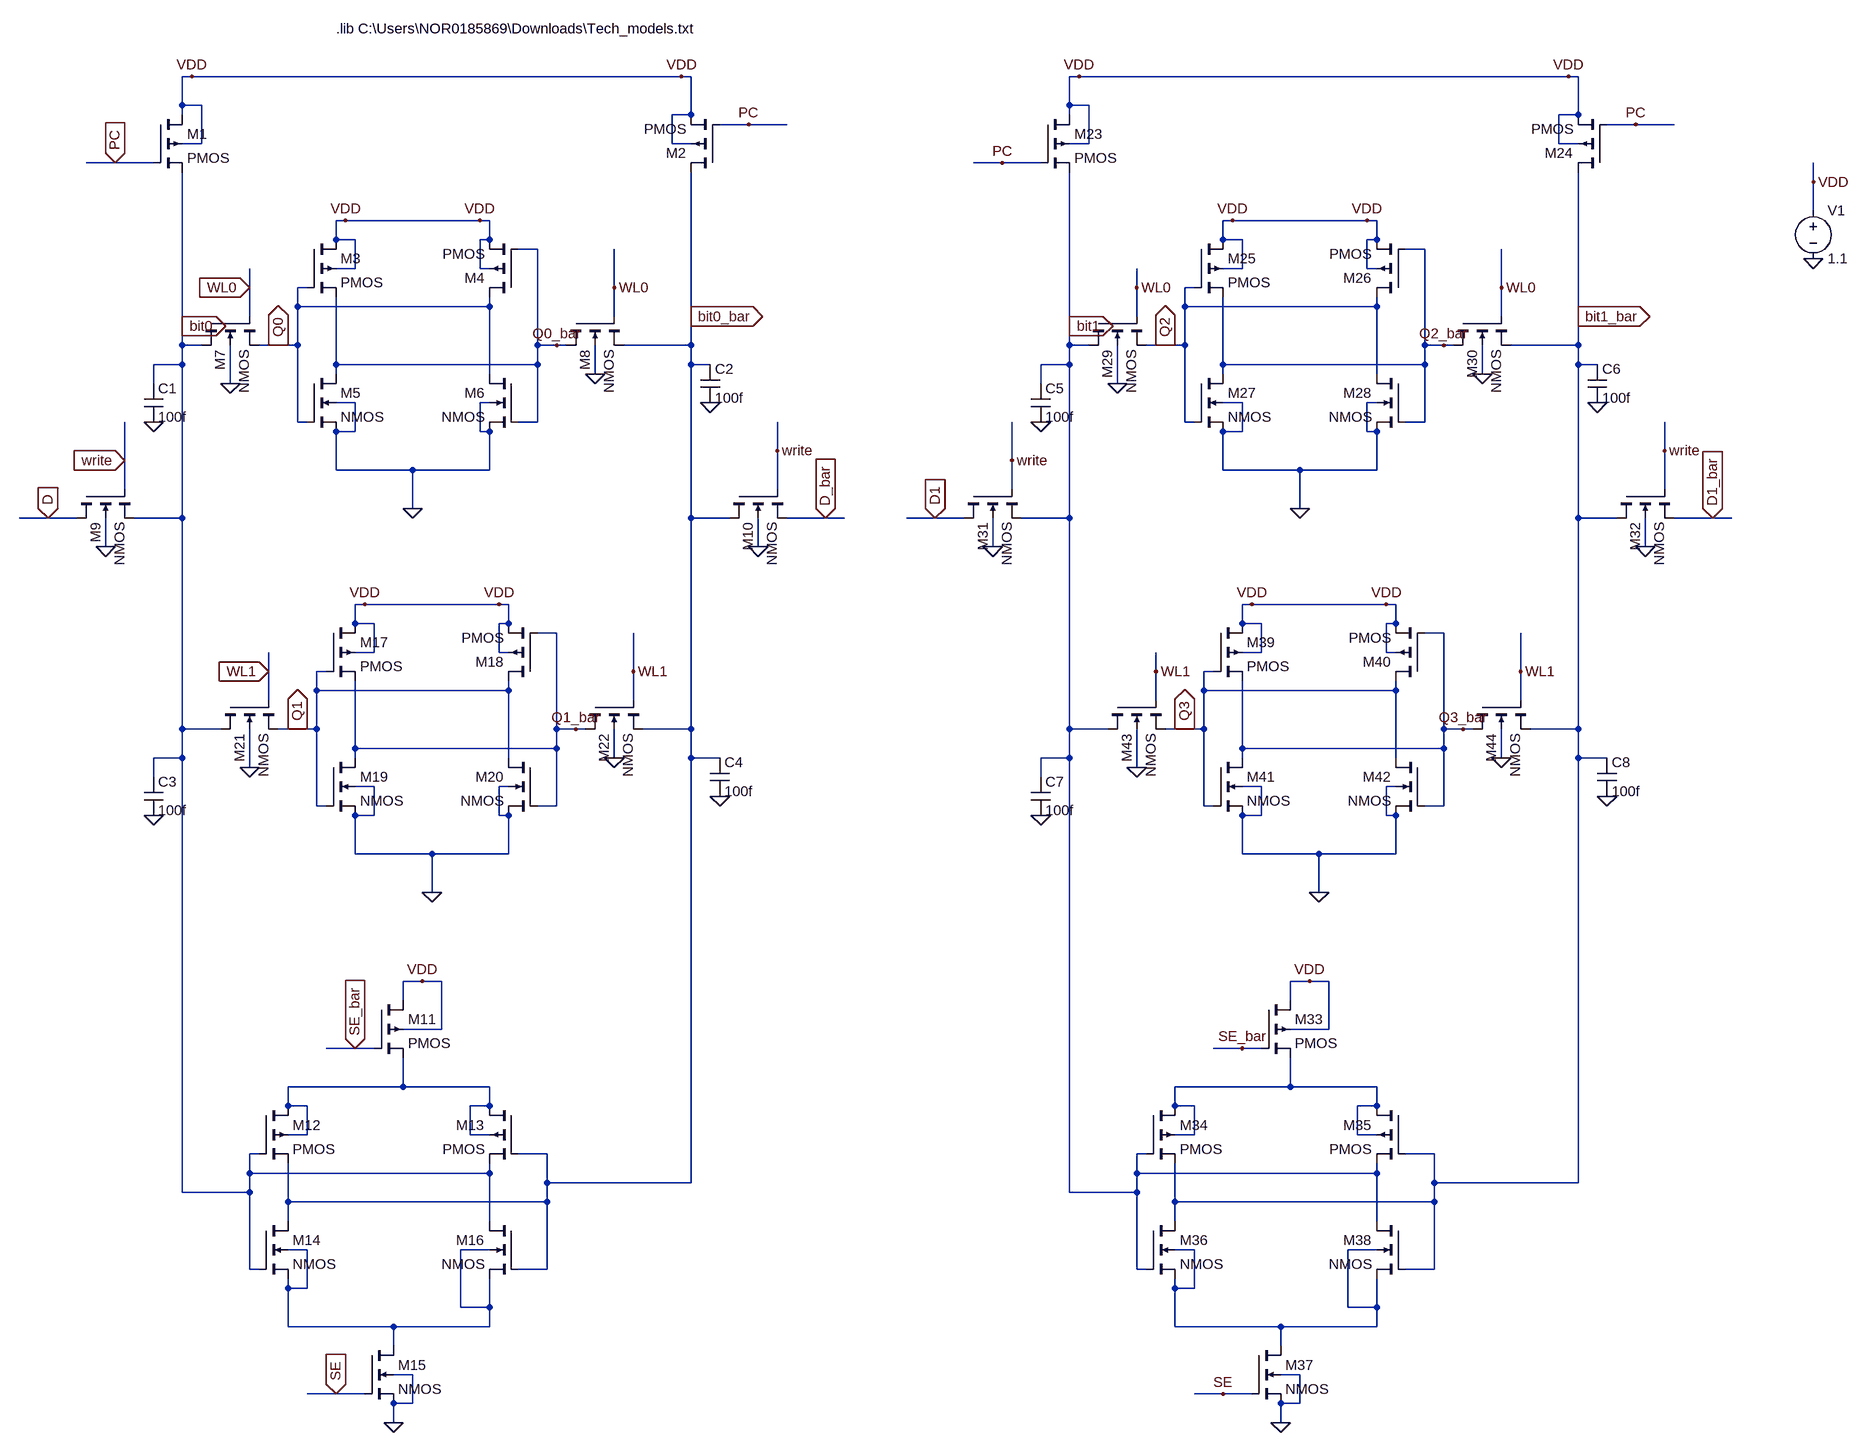
[diagram p0: schematic SRAM2x2.asc]
SRAM2x2.asc, the LTspice schematic file:
Version 4
SHEET 1 2384 2436
WIRE -688 160 -704 160
WIRE 128 160 -688 160
WIRE 144 160 128 160
WIRE 896 160 880 160
WIRE 1712 160 896 160
WIRE 1728 160 1712 160
WIRE -704 208 -704 160
WIRE -672 208 -704 208
WIRE 880 208 880 160
WIRE 912 208 880 208
WIRE -704 224 -704 208
WIRE 144 224 144 160
WIRE 144 224 112 224
WIRE 880 224 880 208
WIRE 1728 224 1728 160
WIRE 1728 224 1696 224
WIRE 240 240 192 240
WIRE 304 240 240 240
WIRE 1824 240 1776 240
WIRE 1888 240 1824 240
WIRE -672 272 -672 208
WIRE -672 272 -704 272
WIRE 112 272 112 224
WIRE 144 272 112 272
WIRE 912 272 912 208
WIRE 912 272 880 272
WIRE 1696 272 1696 224
WIRE 1728 272 1696 272
WIRE -816 304 -864 304
WIRE -752 304 -816 304
WIRE 768 304 720 304
WIRE 832 304 768 304
WIRE 2320 336 2320 304
WIRE 2320 384 2320 336
WIRE -432 400 -448 400
WIRE -208 400 -432 400
WIRE -192 400 -208 400
WIRE 1152 400 1136 400
WIRE 1376 400 1152 400
WIRE 1392 400 1376 400
WIRE -448 432 -448 400
WIRE -416 432 -448 432
WIRE -192 432 -192 400
WIRE -192 432 -208 432
WIRE 1136 432 1136 400
WIRE 1168 432 1136 432
WIRE 1392 432 1392 400
WIRE 1392 432 1376 432
WIRE -112 448 -144 448
WIRE 1472 448 1440 448
WIRE -416 480 -416 432
WIRE -416 480 -448 480
WIRE -208 480 -208 432
WIRE -192 480 -208 480
WIRE 1168 480 1168 432
WIRE 1168 480 1136 480
WIRE 1376 480 1376 432
WIRE 1392 480 1376 480
WIRE -592 512 -592 480
WIRE -496 512 -512 512
WIRE 16 512 16 448
WIRE 992 512 992 480
WIRE 1088 512 1072 512
WIRE 1600 512 1600 448
WIRE -512 544 -512 512
WIRE -192 544 -192 528
WIRE -192 544 -512 544
WIRE 1072 544 1072 512
WIRE 1392 544 1392 528
WIRE 1392 544 1072 544
WIRE -592 560 -592 512
WIRE 16 560 16 512
WIRE 144 560 144 320
WIRE 992 560 992 512
WIRE 1600 560 1600 512
WIRE 1728 560 1728 320
WIRE -704 576 -704 320
WIRE 880 576 880 320
WIRE -704 608 -704 576
WIRE -672 608 -704 608
WIRE -544 608 -576 608
WIRE -512 608 -512 544
WIRE -512 608 -544 608
WIRE -112 608 -112 448
WIRE -80 608 -112 608
WIRE -64 608 -80 608
WIRE 144 608 144 560
WIRE 144 608 32 608
WIRE 880 608 880 576
WIRE 912 608 880 608
WIRE 1040 608 1008 608
WIRE 1072 608 1072 544
WIRE 1072 608 1040 608
WIRE 1472 608 1472 448
WIRE 1504 608 1472 608
WIRE 1520 608 1504 608
WIRE 1728 608 1728 560
WIRE 1728 608 1616 608
WIRE -704 640 -704 608
WIRE -704 640 -752 640
WIRE -448 640 -448 528
WIRE -112 640 -112 608
WIRE -112 640 -448 640
WIRE 144 640 144 608
WIRE 176 640 144 640
WIRE 880 640 880 608
WIRE 880 640 832 640
WIRE 1136 640 1136 528
WIRE 1472 640 1472 608
WIRE 1472 640 1136 640
WIRE 1728 640 1728 608
WIRE 1760 640 1728 640
WIRE -448 656 -448 640
WIRE -192 656 -192 544
WIRE -16 656 -16 608
WIRE 1136 656 1136 640
WIRE 1392 656 1392 544
WIRE 1568 656 1568 608
WIRE -752 672 -752 640
WIRE -624 672 -624 608
WIRE 832 672 832 640
WIRE 960 672 960 608
WIRE -416 704 -448 704
WIRE -192 704 -208 704
WIRE 1168 704 1136 704
WIRE 1392 704 1376 704
WIRE -512 736 -512 608
WIRE -496 736 -512 736
WIRE -112 736 -112 640
WIRE -112 736 -144 736
WIRE 1072 736 1072 608
WIRE 1088 736 1072 736
WIRE 1472 736 1472 640
WIRE 1472 736 1440 736
WIRE -416 752 -416 704
WIRE -416 752 -448 752
WIRE -208 752 -208 704
WIRE -192 752 -208 752
WIRE 1168 752 1168 704
WIRE 1168 752 1136 752
WIRE 1376 752 1376 704
WIRE 1392 752 1376 752
WIRE 288 784 288 736
WIRE 1872 784 1872 736
WIRE -800 800 -800 736
WIRE 784 800 784 736
WIRE -448 816 -448 752
WIRE -320 816 -448 816
WIRE -192 816 -192 752
WIRE -192 816 -320 816
WIRE 1136 816 1136 752
WIRE 1264 816 1136 816
WIRE 1392 816 1392 752
WIRE 1392 816 1264 816
WIRE -800 848 -800 800
WIRE 288 848 288 784
WIRE 784 848 784 800
WIRE 1872 848 1872 784
WIRE -320 880 -320 816
WIRE 1264 880 1264 816
WIRE -928 896 -976 896
WIRE -880 896 -928 896
WIRE -704 896 -704 640
WIRE -704 896 -784 896
WIRE 144 896 144 640
WIRE 208 896 144 896
WIRE 368 896 304 896
WIRE 400 896 368 896
WIRE 656 896 608 896
WIRE 704 896 656 896
WIRE 880 896 880 640
WIRE 880 896 800 896
WIRE 1728 896 1728 640
WIRE 1792 896 1728 896
WIRE 1952 896 1888 896
WIRE 1984 896 1952 896
WIRE -832 944 -832 896
WIRE 256 944 256 896
WIRE 752 944 752 896
WIRE 1840 944 1840 896
WIRE -400 1040 -416 1040
WIRE -176 1040 -400 1040
WIRE -160 1040 -176 1040
WIRE 1184 1040 1168 1040
WIRE 1408 1040 1184 1040
WIRE 1424 1040 1408 1040
WIRE -416 1072 -416 1040
WIRE -384 1072 -416 1072
WIRE -160 1072 -160 1040
WIRE -160 1072 -176 1072
WIRE 1168 1072 1168 1040
WIRE 1200 1072 1168 1072
WIRE 1424 1072 1424 1040
WIRE 1424 1072 1408 1072
WIRE -80 1088 -112 1088
WIRE 1504 1088 1472 1088
WIRE -384 1120 -384 1072
WIRE -384 1120 -416 1120
WIRE -176 1120 -176 1072
WIRE -160 1120 -176 1120
WIRE 1200 1120 1200 1072
WIRE 1200 1120 1168 1120
WIRE 1408 1120 1408 1072
WIRE 1424 1120 1408 1120
WIRE -560 1152 -560 1120
WIRE -464 1152 -480 1152
WIRE 48 1152 48 1088
WIRE 1024 1152 1024 1120
WIRE 1120 1152 1104 1152
WIRE 1632 1152 1632 1088
WIRE -480 1184 -480 1152
WIRE -160 1184 -160 1168
WIRE -160 1184 -480 1184
WIRE 1104 1184 1104 1152
WIRE 1424 1184 1424 1168
WIRE 1424 1184 1104 1184
WIRE -560 1200 -560 1152
WIRE 48 1200 48 1152
WIRE 1024 1200 1024 1152
WIRE 1632 1200 1632 1152
WIRE -704 1248 -704 896
WIRE -640 1248 -704 1248
WIRE -512 1248 -544 1248
WIRE -480 1248 -480 1184
WIRE -480 1248 -512 1248
WIRE -80 1248 -80 1088
WIRE -48 1248 -80 1248
WIRE -32 1248 -48 1248
WIRE 144 1248 144 896
WIRE 144 1248 64 1248
WIRE 880 1248 880 896
WIRE 944 1248 880 1248
WIRE 1072 1248 1040 1248
WIRE 1104 1248 1104 1184
WIRE 1104 1248 1072 1248
WIRE 1504 1248 1504 1088
WIRE 1536 1248 1504 1248
WIRE 1552 1248 1536 1248
WIRE 1728 1248 1728 896
WIRE 1728 1248 1648 1248
WIRE -416 1280 -416 1168
WIRE -80 1280 -80 1248
WIRE -80 1280 -416 1280
WIRE 1168 1280 1168 1168
WIRE 1504 1280 1504 1248
WIRE 1504 1280 1168 1280
WIRE -704 1296 -704 1248
WIRE -704 1296 -752 1296
WIRE -416 1296 -416 1280
WIRE -160 1296 -160 1184
WIRE 16 1296 16 1248
WIRE 144 1296 144 1248
WIRE 192 1296 144 1296
WIRE 880 1296 880 1248
WIRE 880 1296 832 1296
WIRE 1168 1296 1168 1280
WIRE 1424 1296 1424 1184
WIRE 1600 1296 1600 1248
WIRE 1728 1296 1728 1248
WIRE 1776 1296 1728 1296
WIRE -592 1312 -592 1248
WIRE 992 1312 992 1248
WIRE -752 1328 -752 1296
WIRE 832 1328 832 1296
WIRE -384 1344 -416 1344
WIRE -160 1344 -176 1344
WIRE 1200 1344 1168 1344
WIRE 1424 1344 1408 1344
WIRE -480 1376 -480 1248
WIRE -464 1376 -480 1376
WIRE -80 1376 -80 1280
WIRE -80 1376 -112 1376
WIRE 1104 1376 1104 1248
WIRE 1120 1376 1104 1376
WIRE 1504 1376 1504 1280
WIRE 1504 1376 1472 1376
WIRE -384 1392 -384 1344
WIRE -384 1392 -416 1392
WIRE -176 1392 -176 1344
WIRE -160 1392 -176 1392
WIRE 1200 1392 1200 1344
WIRE 1200 1392 1168 1392
WIRE 1408 1392 1408 1344
WIRE 1424 1392 1408 1392
WIRE -416 1456 -416 1392
WIRE -288 1456 -416 1456
WIRE -160 1456 -160 1392
WIRE -160 1456 -288 1456
WIRE 1168 1456 1168 1392
WIRE 1296 1456 1168 1456
WIRE 1424 1456 1424 1392
WIRE 1424 1456 1296 1456
WIRE -288 1520 -288 1456
WIRE 1296 1520 1296 1456
WIRE -304 1680 -336 1680
WIRE -272 1680 -304 1680
WIRE 1280 1680 1248 1680
WIRE 1312 1680 1280 1680
WIRE -336 1712 -336 1680
WIRE 1248 1712 1248 1680
WIRE -272 1760 -272 1680
WIRE -272 1760 -336 1760
WIRE 1312 1760 1312 1680
WIRE 1312 1760 1248 1760
WIRE -416 1792 -464 1792
WIRE -384 1792 -416 1792
WIRE 1168 1792 1120 1792
WIRE 1200 1792 1168 1792
WIRE -336 1856 -336 1808
WIRE -336 1856 -528 1856
WIRE -192 1856 -336 1856
WIRE 1248 1856 1248 1808
WIRE 1248 1856 1056 1856
WIRE 1392 1856 1248 1856
WIRE -528 1888 -528 1856
WIRE -496 1888 -528 1888
WIRE -192 1888 -192 1856
WIRE -192 1888 -224 1888
WIRE 1056 1888 1056 1856
WIRE 1088 1888 1056 1888
WIRE 1392 1888 1392 1856
WIRE 1392 1888 1360 1888
WIRE -496 1936 -496 1888
WIRE -496 1936 -528 1936
WIRE -224 1936 -224 1888
WIRE -192 1936 -224 1936
WIRE 1088 1936 1088 1888
WIRE 1088 1936 1056 1936
WIRE 1360 1936 1360 1888
WIRE 1392 1936 1360 1936
WIRE -576 1968 -592 1968
WIRE -96 1968 -144 1968
WIRE 1008 1968 992 1968
WIRE 1488 1968 1440 1968
WIRE -592 2000 -592 1968
WIRE -192 2000 -192 1984
WIRE -192 2000 -592 2000
WIRE 992 2000 992 1968
WIRE 1392 2000 1392 1984
WIRE 1392 2000 992 2000
WIRE -96 2016 -96 1968
WIRE 144 2016 144 1296
WIRE 144 2016 -96 2016
WIRE 1488 2016 1488 1968
WIRE 1728 2016 1728 1296
WIRE 1728 2016 1488 2016
WIRE -704 2032 -704 1296
WIRE -592 2032 -592 2000
WIRE -592 2032 -704 2032
WIRE 880 2032 880 1296
WIRE 992 2032 992 2000
WIRE 992 2032 880 2032
WIRE -528 2048 -528 1984
WIRE -96 2048 -96 2016
WIRE -96 2048 -528 2048
WIRE 1056 2048 1056 1984
WIRE 1488 2048 1488 2016
WIRE 1488 2048 1056 2048
WIRE -528 2080 -528 2048
WIRE -192 2080 -192 2000
WIRE 1056 2080 1056 2048
WIRE 1392 2080 1392 2000
WIRE -496 2128 -528 2128
WIRE -192 2128 -240 2128
WIRE 1088 2128 1056 2128
WIRE 1392 2128 1344 2128
WIRE -592 2160 -592 2032
WIRE -576 2160 -592 2160
WIRE -96 2160 -96 2048
WIRE -96 2160 -144 2160
WIRE 992 2160 992 2032
WIRE 1008 2160 992 2160
WIRE 1488 2160 1488 2048
WIRE 1488 2160 1440 2160
WIRE -528 2192 -528 2176
WIRE -496 2192 -496 2128
WIRE -496 2192 -528 2192
WIRE 1056 2192 1056 2176
WIRE 1088 2192 1088 2128
WIRE 1088 2192 1056 2192
WIRE -240 2224 -240 2128
WIRE -192 2224 -192 2176
WIRE -192 2224 -240 2224
WIRE 1344 2224 1344 2128
WIRE 1392 2224 1392 2176
WIRE 1392 2224 1344 2224
WIRE -528 2256 -528 2192
WIRE -352 2256 -528 2256
WIRE -192 2256 -192 2224
WIRE -192 2256 -352 2256
WIRE 1056 2256 1056 2192
WIRE 1232 2256 1056 2256
WIRE 1392 2256 1392 2224
WIRE 1392 2256 1232 2256
WIRE -352 2288 -352 2256
WIRE 1232 2288 1232 2256
WIRE -320 2336 -352 2336
WIRE 1264 2336 1232 2336
WIRE -448 2368 -496 2368
WIRE -400 2368 -448 2368
WIRE 1136 2368 1088 2368
WIRE 1184 2368 1136 2368
WIRE -320 2384 -320 2336
WIRE -320 2384 -352 2384
WIRE 1264 2384 1264 2336
WIRE 1264 2384 1232 2384
WIRE -352 2416 -352 2384
WIRE 1232 2416 1232 2384
FLAG -624 672 0
FLAG -16 656 0
FLAG -320 880 0
FLAG 256 944 0
FLAG -832 944 0
FLAG -352 2416 0
FLAG -688 160 VDD
FLAG 128 160 VDD
FLAG -304 1680 VDD
FLAG -816 304 PC
IOPIN -816 304 In
FLAG 240 240 PC
FLAG -592 512 WL0
IOPIN -592 512 In
FLAG 16 512 WL0
FLAG -704 576 bit0
IOPIN -704 576 Out
FLAG 144 560 bit0_bar
IOPIN 144 560 Out
FLAG -80 608 Q0_bar
FLAG -544 608 Q0
IOPIN -544 608 Out
FLAG -800 800 write
IOPIN -800 800 In
FLAG -928 896 D
IOPIN -928 896 In
FLAG 288 784 write
FLAG 368 896 D_bar
IOPIN 368 896 In
FLAG -416 1792 SE_bar
IOPIN -416 1792 In
FLAG -448 2368 SE
IOPIN -448 2368 In
FLAG -752 736 0
FLAG 176 704 0
FLAG -432 400 VDD
FLAG -208 400 VDD
FLAG -592 1312 0
FLAG 16 1296 0
FLAG -288 1520 0
FLAG -560 1152 WL1
IOPIN -560 1152 In
FLAG 48 1152 WL1
FLAG -48 1248 Q1_bar
FLAG -512 1248 Q1
IOPIN -512 1248 Out
FLAG -400 1040 VDD
FLAG -176 1040 VDD
FLAG -752 1392 0
FLAG 192 1360 0
FLAG 960 672 0
FLAG 1568 656 0
FLAG 1264 880 0
FLAG 1840 944 0
FLAG 752 944 0
FLAG 1232 2416 0
FLAG 896 160 VDD
FLAG 1712 160 VDD
FLAG 1280 1680 VDD
FLAG 768 304 PC
FLAG 1824 240 PC
FLAG 992 512 WL0
FLAG 1600 512 WL0
FLAG 880 576 bit1
IOPIN 880 576 Out
FLAG 1728 560 bit1_bar
IOPIN 1728 560 Out
FLAG 1504 608 Q2_bar
FLAG 1040 608 Q2
IOPIN 1040 608 Out
FLAG 784 800 write
FLAG 656 896 D1
IOPIN 656 896 In
FLAG 1872 784 write
FLAG 1952 896 D1_bar
IOPIN 1952 896 In
FLAG 1168 1792 SE_bar
FLAG 1136 2368 SE
FLAG 832 736 0
FLAG 1760 704 0
FLAG 1152 400 VDD
FLAG 1376 400 VDD
FLAG 992 1312 0
FLAG 1600 1296 0
FLAG 1296 1520 0
FLAG 1024 1152 WL1
FLAG 1632 1152 WL1
FLAG 1536 1248 Q3_bar
FLAG 1072 1248 Q3
IOPIN 1072 1248 Out
FLAG 1184 1040 VDD
FLAG 1408 1040 VDD
FLAG 832 1392 0
FLAG 1776 1360 0
FLAG 2320 464 0
FLAG 2320 336 VDD
SYMBOL pmos4 -752 224 R0
SYMATTR InstName M1
SYMATTR Value2 l=32n w=1280n
SYMBOL pmos4 192 320 R180
SYMATTR InstName M2
SYMATTR Value2 l=32n  w=1280n
SYMBOL pmos4 -496 432 R0
SYMATTR InstName M3
SYMATTR Value2 l=250n w=600n
SYMBOL pmos4 -144 528 R180
SYMATTR InstName M4
SYMATTR Value2 l=250n  w=600n
SYMBOL nmos4 -496 656 R0
SYMATTR InstName M5
SYMATTR Value2 l=32n w=64n
SYMBOL nmos4 -144 656 M0
SYMATTR InstName M6
SYMATTR Value2 l=32n w=64n
SYMBOL nmos4 -672 560 M90
SYMATTR InstName M7
SYMATTR Value2 l=250n w=100n
SYMBOL nmos4 -64 560 M90
SYMATTR InstName M8
SYMATTR Value2 l=250n w=100n
SYMBOL nmos4 -880 848 M90
SYMATTR InstName M9
SYMATTR Value2 l=32n w=1000n
SYMBOL nmos4 208 848 M90
SYMATTR InstName M10
SYMATTR Value2 l=32n w=1000n
SYMBOL pmos4 -384 1712 R0
SYMATTR InstName M11
SYMATTR Value2 l=32n w=640n
SYMBOL pmos4 -576 1888 R0
SYMATTR InstName M12
SYMATTR Value2 l=32n w=64n
SYMBOL pmos4 -144 1888 M0
SYMATTR InstName M13
SYMATTR Value2 l=32n w=64n
SYMBOL nmos4 -576 2080 R0
SYMATTR InstName M14
SYMATTR Value2 l=32n w=640n
SYMBOL nmos4 -400 2288 R0
SYMATTR InstName M15
SYMATTR Value2 l=32n w=640n
SYMBOL nmos4 -144 2080 M0
SYMATTR InstName M16
SYMATTR Value2 l=32n w=640n
SYMBOL cap -768 672 R0
SYMATTR InstName C1
SYMATTR Value 100f
SYMBOL cap 160 640 R0
SYMATTR InstName C2
SYMATTR Value 100f
SYMBOL pmos4 -464 1072 R0
SYMATTR InstName M17
SYMATTR Value2 l=250n w=600n
SYMBOL pmos4 -112 1168 R180
SYMATTR InstName M18
SYMATTR Value2 l=250n  w=600n
SYMBOL nmos4 -464 1296 R0
SYMATTR InstName M19
SYMATTR Value2 l=32n w=64n
SYMBOL nmos4 -112 1296 M0
SYMATTR InstName M20
SYMATTR Value2 l=32n w=64n
SYMBOL nmos4 -640 1200 M90
SYMATTR InstName M21
SYMATTR Value2 l=250n w=100n
SYMBOL nmos4 -32 1200 M90
SYMATTR InstName M22
SYMATTR Value2 l=250n w=100n
SYMBOL cap -768 1328 R0
SYMATTR InstName C3
SYMATTR Value 100f
SYMBOL cap 176 1296 R0
SYMATTR InstName C4
SYMATTR Value 100f
SYMBOL pmos4 832 224 R0
SYMATTR InstName M23
SYMATTR Value2 l=32n w=1280n
SYMBOL pmos4 1776 320 R180
SYMATTR InstName M24
SYMATTR Value2 l=32n  w=1280n
SYMBOL pmos4 1088 432 R0
SYMATTR InstName M25
SYMATTR Value2 l=250n w=600n
SYMBOL pmos4 1440 528 R180
SYMATTR InstName M26
SYMATTR Value2 l=250n  w=600n
SYMBOL nmos4 1088 656 R0
SYMATTR InstName M27
SYMATTR Value2 l=32n w=64n
SYMBOL nmos4 1440 656 M0
SYMATTR InstName M28
SYMATTR Value2 l=32n w=64n
SYMBOL nmos4 912 560 M90
SYMATTR InstName M29
SYMATTR Value2 l=250n w=100n
SYMBOL nmos4 1520 560 M90
SYMATTR InstName M30
SYMATTR Value2 l=250n w=100n
SYMBOL nmos4 704 848 M90
SYMATTR InstName M31
SYMATTR Value2 l=32n w=1000n
SYMBOL nmos4 1792 848 M90
SYMATTR InstName M32
SYMATTR Value2 l=32n w=1000n
SYMBOL pmos4 1200 1712 R0
SYMATTR InstName M33
SYMATTR Value2 l=32n w=640n
SYMBOL pmos4 1008 1888 R0
SYMATTR InstName M34
SYMATTR Value2 l=32n w=64n
SYMBOL pmos4 1440 1888 M0
SYMATTR InstName M35
SYMATTR Value2 l=32n w=64n
SYMBOL nmos4 1008 2080 R0
SYMATTR InstName M36
SYMATTR Value2 l=32n w=640n
SYMBOL nmos4 1184 2288 R0
SYMATTR InstName M37
SYMATTR Value2 l=32n w=640n
SYMBOL nmos4 1440 2080 M0
SYMATTR InstName M38
SYMATTR Value2 l=32n w=640n
SYMBOL cap 816 672 R0
SYMATTR InstName C5
SYMATTR Value 100f
SYMBOL cap 1744 640 R0
SYMATTR InstName C6
SYMATTR Value 100f
SYMBOL pmos4 1120 1072 R0
SYMATTR InstName M39
SYMATTR Value2 l=250n w=600n
SYMBOL pmos4 1472 1168 R180
SYMATTR InstName M40
SYMATTR Value2 l=250n  w=600n
SYMBOL nmos4 1120 1296 R0
SYMATTR InstName M41
SYMATTR Value2 l=32n w=64n
SYMBOL nmos4 1472 1296 M0
SYMATTR InstName M42
SYMATTR Value2 l=32n w=64n
SYMBOL nmos4 944 1200 M90
SYMATTR InstName M43
SYMATTR Value2 l=250n w=100n
SYMBOL nmos4 1552 1200 M90
SYMATTR InstName M44
SYMATTR Value2 l=250n w=100n
SYMBOL cap 816 1328 R0
SYMATTR InstName C7
SYMATTR Value 100f
SYMBOL cap 1760 1296 R0
SYMATTR InstName C8
SYMATTR Value 100f
SYMBOL voltage 2320 368 R0
WINDOW 123 0 0 Left 0
WINDOW 39 0 0 Left 0
SYMATTR InstName V1
SYMATTR Value 1.1
TEXT -448 80 Left 2 !.lib C:\\Users\\NOR0185869\\Downloads\\Tech_models.txt

The netlist it stands for:
* SRAM2x2.asc
M1 VDD PC bit0 VDD PMOS l=32n w=1280n
M2 bit0_bar PC VDD VDD PMOS l=32n  w=1280n
M3 VDD Q0 Q0_bar VDD PMOS l=250n w=600n
M4 Q0 Q0_bar VDD VDD PMOS l=250n  w=600n
M5 Q0_bar Q0 0 0 NMOS l=32n w=64n
M6 Q0 Q0_bar 0 0 NMOS l=32n w=64n
M7 bit0 WL0 Q0 0 NMOS l=250n w=100n
M8 Q0_bar WL0 bit0_bar 0 NMOS l=250n w=100n
M9 D write bit0 0 NMOS l=32n w=1000n
M10 bit0_bar write D_bar 0 NMOS l=32n w=1000n
M11 VDD SE_bar N001 VDD PMOS l=32n w=640n
M12 N001 bit0 bit0_bar N001 PMOS l=32n w=64n
M13 N001 bit0_bar bit0 N001 PMOS l=32n w=64n
M14 bit0_bar bit0 N003 N003 NMOS l=32n w=640n
M15 N003 SE 0 0 NMOS l=32n w=640n
M16 bit0 bit0_bar N003 N003 NMOS l=32n w=640n
C1 bit0 0 100f
C2 bit0_bar 0 100f
M17 VDD Q1 Q1_bar VDD PMOS l=250n w=600n
M18 Q1 Q1_bar VDD VDD PMOS l=250n  w=600n
M19 Q1_bar Q1 0 0 NMOS l=32n w=64n
M20 Q1 Q1_bar 0 0 NMOS l=32n w=64n
M21 bit0 WL1 Q1 0 NMOS l=250n w=100n
M22 Q1_bar WL1 bit0_bar 0 NMOS l=250n w=100n
C3 bit0 0 100f
C4 bit0_bar 0 100f
M23 VDD PC bit1 VDD PMOS l=32n w=1280n
M24 bit1_bar PC VDD VDD PMOS l=32n  w=1280n
M25 VDD Q2 Q2_bar VDD PMOS l=250n w=600n
M26 Q2 Q2_bar VDD VDD PMOS l=250n  w=600n
M27 Q2_bar Q2 0 0 NMOS l=32n w=64n
M28 Q2 Q2_bar 0 0 NMOS l=32n w=64n
M29 bit1 WL0 Q2 0 NMOS l=250n w=100n
M30 Q2_bar WL0 bit1_bar 0 NMOS l=250n w=100n
M31 D1 write bit1 0 NMOS l=32n w=1000n
M32 bit1_bar write D1_bar 0 NMOS l=32n w=1000n
M33 VDD SE_bar N002 VDD PMOS l=32n w=640n
M34 N002 bit1 bit1_bar N002 PMOS l=32n w=64n
M35 N002 bit1_bar bit1 N002 PMOS l=32n w=64n
M36 bit1_bar bit1 N004 N004 NMOS l=32n w=640n
M37 N004 SE 0 0 NMOS l=32n w=640n
M38 bit1 bit1_bar N004 N004 NMOS l=32n w=640n
C5 bit1 0 100f
C6 bit1_bar 0 100f
M39 VDD Q3 Q3_bar VDD PMOS l=250n w=600n
M40 Q3 Q3_bar VDD VDD PMOS l=250n  w=600n
M41 Q3_bar Q3 0 0 NMOS l=32n w=64n
M42 Q3 Q3_bar 0 0 NMOS l=32n w=64n
M43 bit1 WL1 Q3 0 NMOS l=250n w=100n
M44 Q3_bar WL1 bit1_bar 0 NMOS l=250n w=100n
C7 bit1 0 100f
C8 bit1_bar 0 100f
V1 VDD 0 1.1
.model NMOS NMOS
.model PMOS PMOS
.lib standard.mos
.lib C:\Users\NOR0185869\Downloads\Tech_models.txt
.backanno
.end